# EasyEDA schematic 1-Schematic_proiect.json
TITLE: Sheet_1; REV: 1.0; Date: 2019-12-05; Sheet: 1/1; Drawn By: tudorana; Company: Your Company
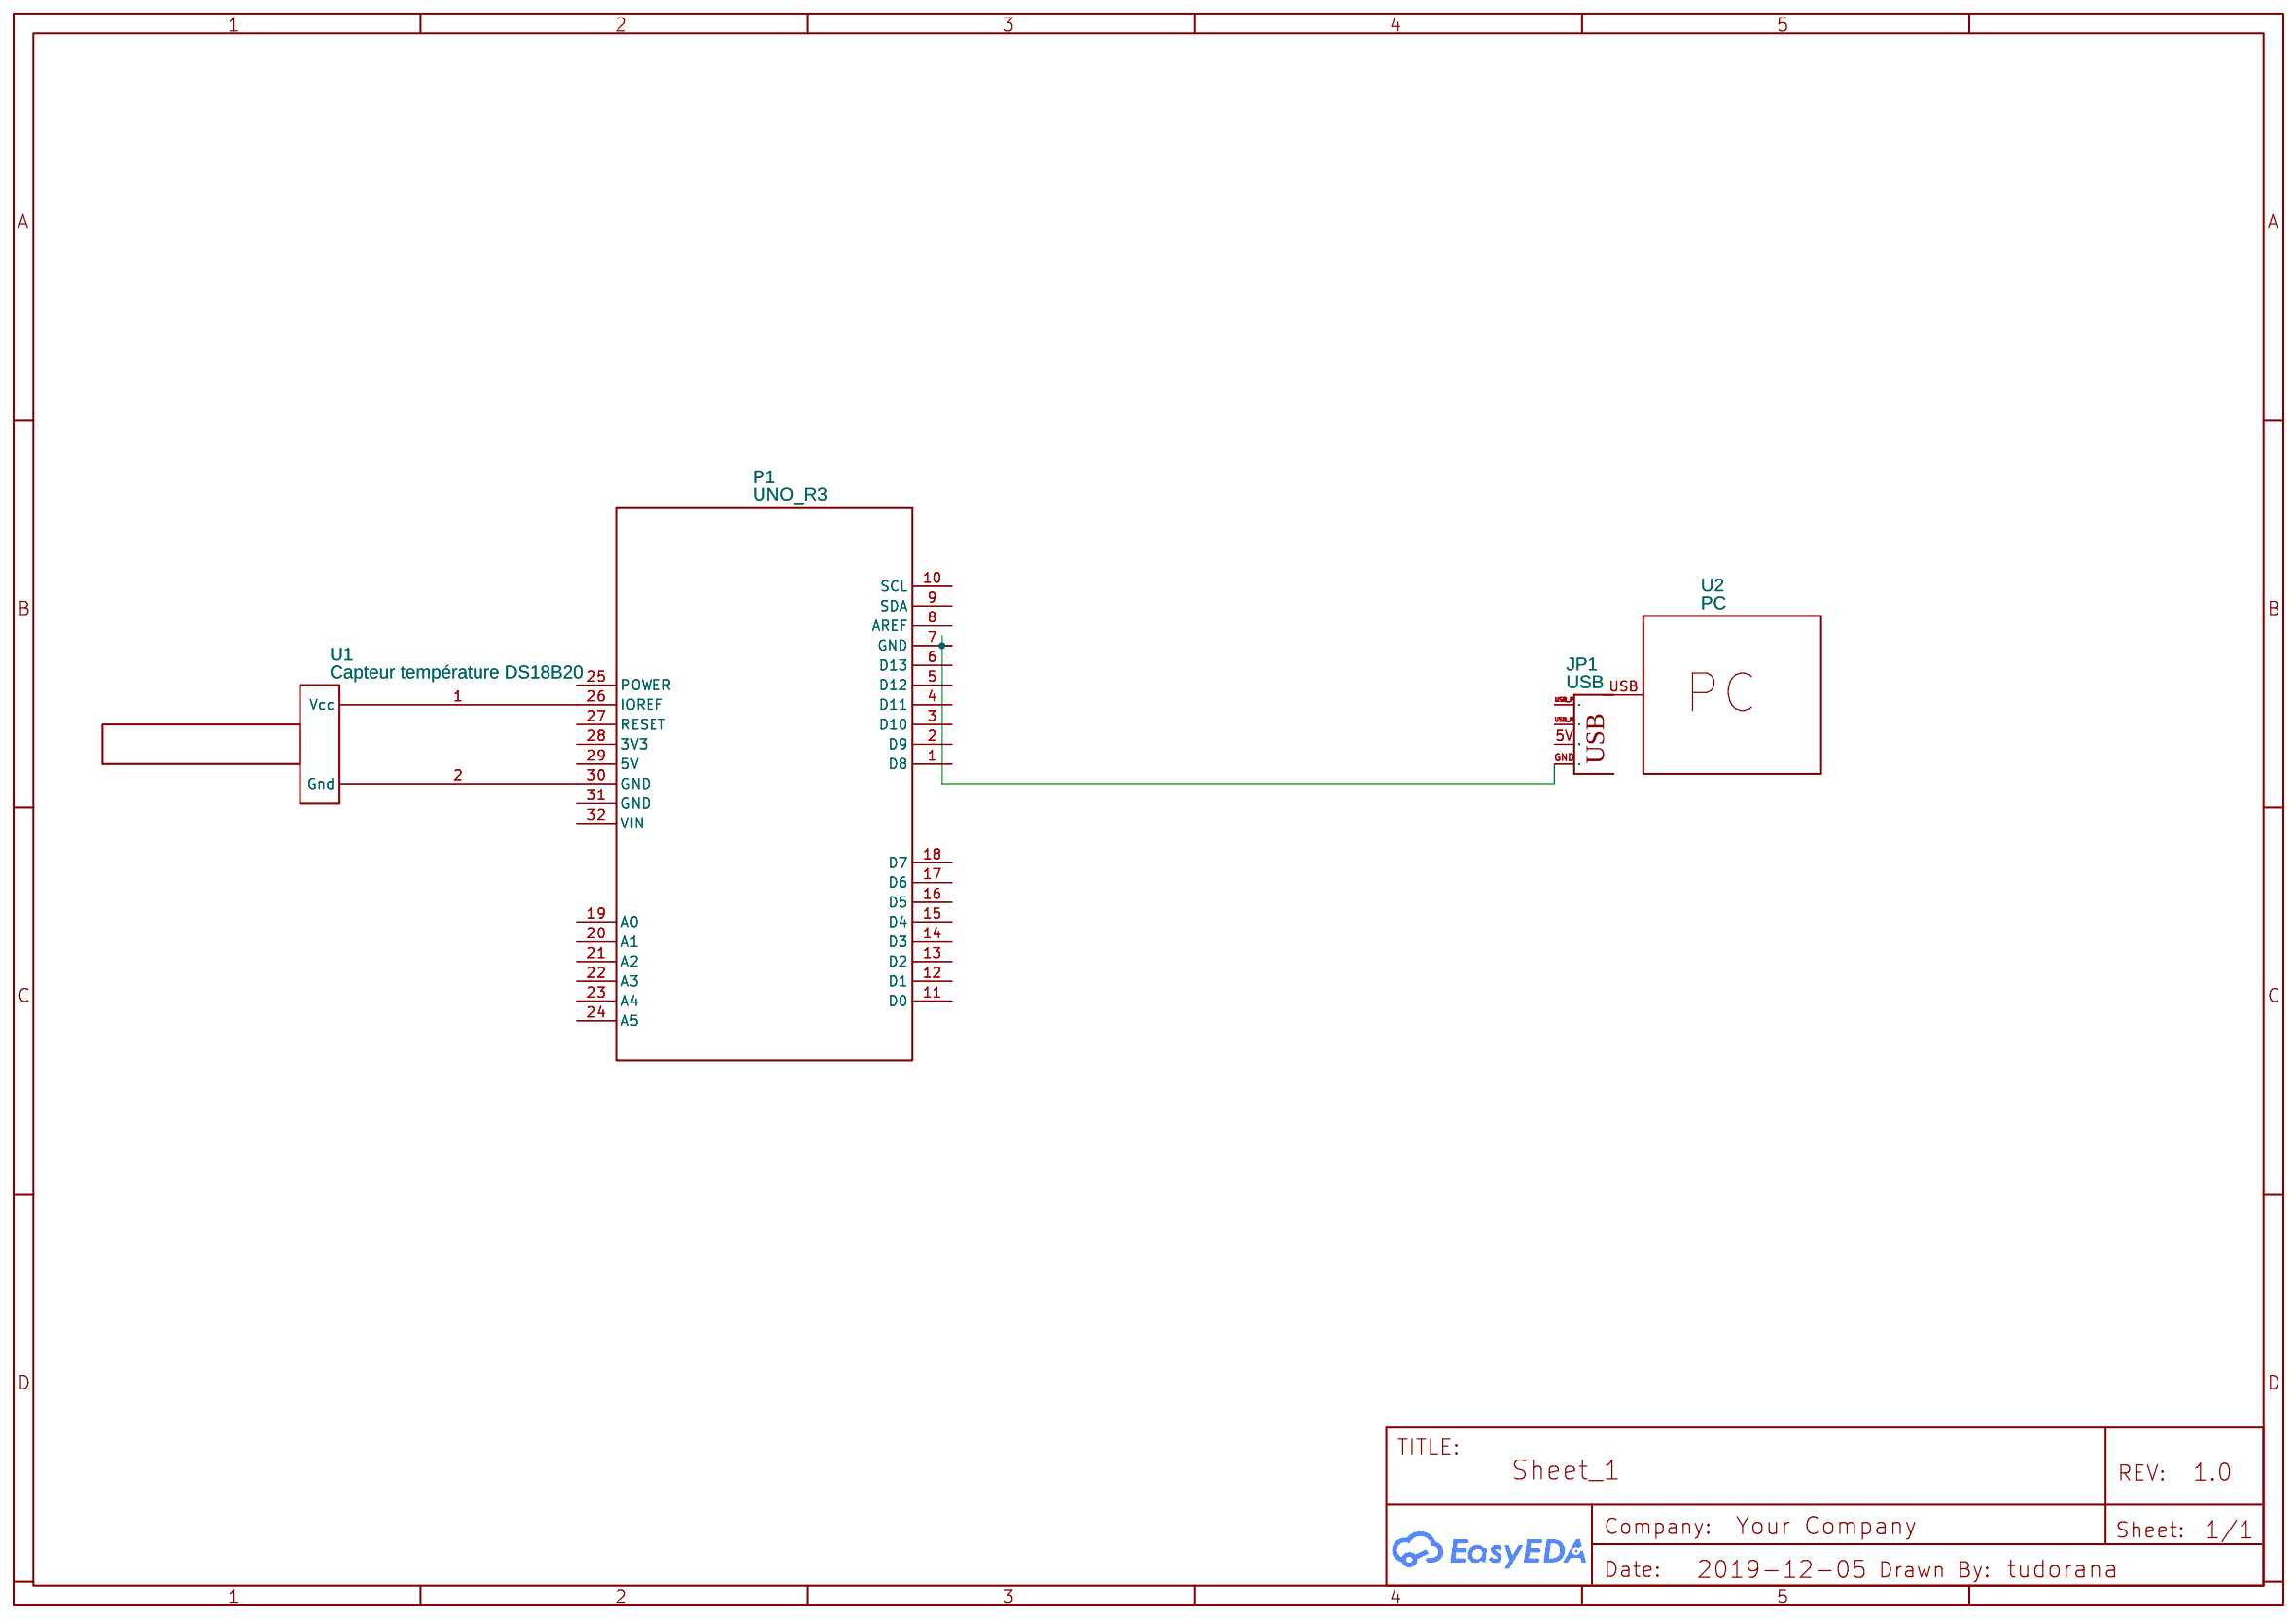
[diagram p0: schematic sheet]

## Parts
JP1  USB  [USB-A-PCB]
P1  UNO_R3  [UNO_R3]
U1  Capteur température DS18B20  [CAPTEUR]
U2  PC

## Library data of the parts
JP1 = -: Contributor: SparkFun
P1 = -: sourceId: 1T5FDZYC8
U1 = -: Contributor: laurent86; sourceId: jMYWwIhRP
U2 = -: Contributor: marsovc

## Nets
Net-(JP1-GND): JP1.GND P1.7(GND)
Net-(P1-26): P1.26(IOREF) U1.1(Vcc)
Net-(P1-30): P1.30(GND) U1.2(Gnd)

Not connected (* = marked no-connect by the designer): JP1 5V(VBUS) USB_M(D-) USB_P(D+); P1 1(D8) 2(D9) 3(D10) 4(D11) 5(D12) 6(D13) 8(AREF) 9(SDA) 10(SCL) 11(D0) 12(D1) 13(D2) 14(D3) 15(D4) 16(D5) 17(D6) 18(D7) 19(A0) 20(A1) 21(A2) 22(A3) 23(A4) 24(A5) 25(POWER) 27(RESET) 28(3V3) 29(5V) 31(GND) 32(VIN); U2 USB(1)
